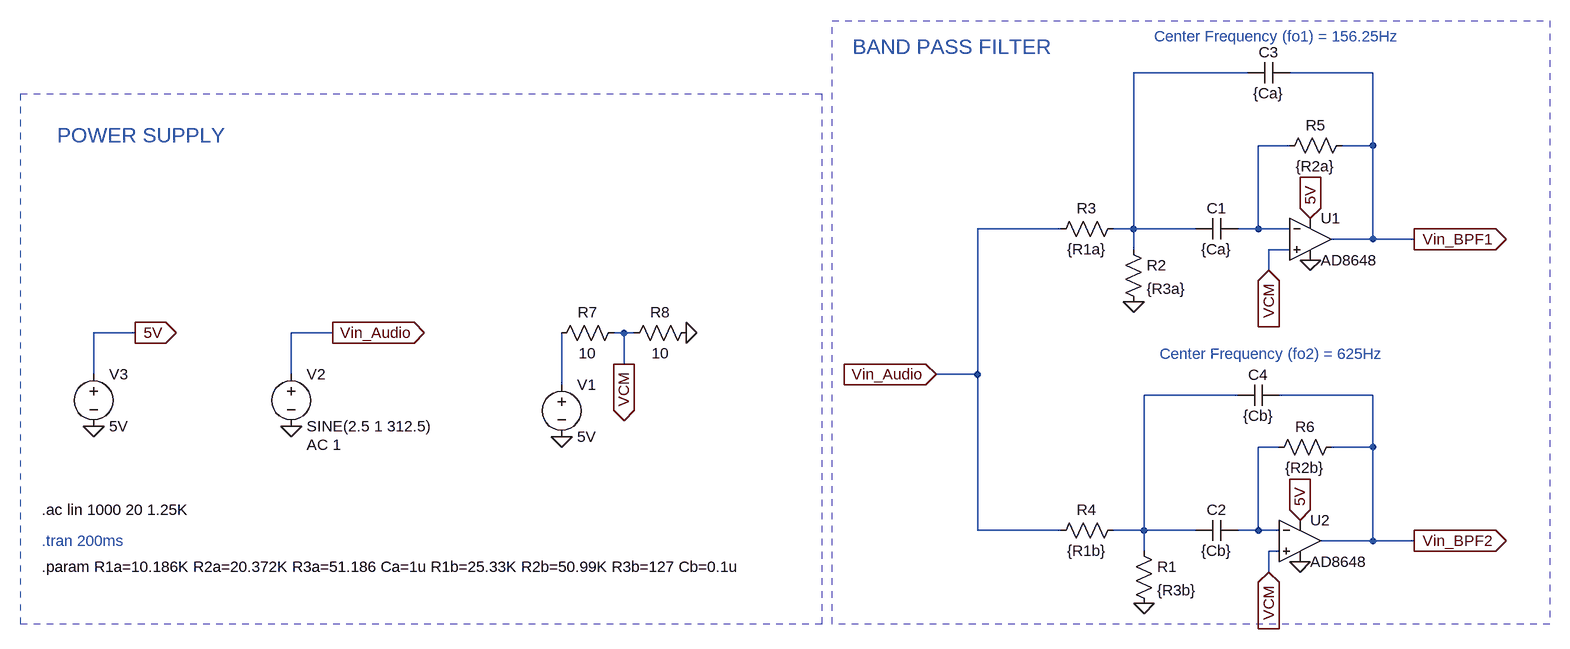
[diagram p0: schematic Analog4,5.asc]
Analog4,5.asc, the LTspice schematic file:
Version 4
SHEET 1 1492 1056
WIRE 256 -208 80 -208
WIRE 448 -208 320 -208
WIRE 320 -96 272 -96
WIRE 448 -96 448 -208
WIRE 448 -96 400 -96
WIRE -32 32 -160 32
WIRE 80 32 80 -208
WIRE 80 32 48 32
WIRE 176 32 80 32
WIRE 272 32 272 -96
WIRE 272 32 240 32
WIRE 320 32 272 32
WIRE 448 48 448 -96
WIRE 448 48 384 48
WIRE 512 48 448 48
WIRE 80 64 80 32
WIRE 320 64 288 64
WIRE 288 96 288 64
WIRE -1456 192 -1520 192
WIRE -1152 192 -1216 192
WIRE -704 192 -720 192
WIRE -688 192 -704 192
WIRE -704 240 -704 192
WIRE -1520 256 -1520 192
WIRE -1216 256 -1216 192
WIRE -160 256 -160 32
WIRE -160 256 -224 256
WIRE -800 272 -800 192
WIRE 240 288 96 288
WIRE 448 288 304 288
WIRE 304 368 272 368
WIRE 448 368 448 288
WIRE 448 368 384 368
WIRE -160 496 -160 256
WIRE -32 496 -160 496
WIRE 96 496 96 288
WIRE 96 496 48 496
WIRE 176 496 96 496
WIRE 272 496 272 368
WIRE 272 496 240 496
WIRE 304 496 272 496
WIRE 448 512 448 368
WIRE 448 512 368 512
WIRE 512 512 448 512
WIRE 96 528 96 496
WIRE 304 528 288 528
WIRE 288 560 288 528
FLAG 352 80 0
FLAG 80 144 0
FLAG 96 608 0
FLAG 336 544 0
FLAG -800 352 0
FLAG -1216 336 0
FLAG -1520 336 0
FLAG -608 192 0
FLAG -224 256 Vin_Audio
IOPIN -224 256 In
FLAG -1152 192 Vin_Audio
IOPIN -1152 192 Out
FLAG 512 48 Vin_BPF1
IOPIN 512 48 Out
FLAG 512 512 Vin_BPF2
IOPIN 512 512 Out
FLAG -1456 192 5V
IOPIN -1456 192 Out
FLAG 352 16 5V
IOPIN 352 16 In
FLAG 336 480 5V
IOPIN 336 480 In
FLAG -704 240 VCM
IOPIN -704 240 Out
FLAG 288 560 VCM
IOPIN 288 560 In
FLAG 288 96 VCM
IOPIN 288 96 In
SYMBOL OpAmps\\AD8648 352 -16 R0
SYMATTR InstName U1
SYMBOL OpAmps\\AD8648 336 448 R0
SYMATTR InstName U2
SYMBOL cap 240 16 R90
WINDOW 0 0 32 VBottom 2
WINDOW 3 32 32 VTop 2
SYMATTR InstName C1
SYMATTR Value {Ca}
SYMBOL cap 240 480 R90
WINDOW 0 0 32 VBottom 2
WINDOW 3 32 32 VTop 2
SYMATTR InstName C2
SYMATTR Value {Cb}
SYMBOL cap 320 -224 R90
WINDOW 0 0 32 VBottom 2
WINDOW 3 32 32 VTop 2
SYMATTR InstName C3
SYMATTR Value {Ca}
SYMBOL cap 304 272 R90
WINDOW 0 0 32 VBottom 2
WINDOW 3 32 32 VTop 2
SYMATTR InstName C4
SYMATTR Value {Cb}
SYMBOL res 80 512 R0
SYMATTR InstName R1
SYMATTR Value {R3b}
SYMBOL res 64 48 R0
SYMATTR InstName R2
SYMATTR Value {R3a}
SYMBOL res 64 16 R90
WINDOW 0 0 56 VBottom 2
WINDOW 3 32 56 VTop 2
SYMATTR InstName R3
SYMATTR Value {R1a}
SYMBOL res 64 480 R90
WINDOW 0 0 56 VBottom 2
WINDOW 3 32 56 VTop 2
SYMATTR InstName R4
SYMATTR Value {R1b}
SYMBOL res 416 -112 R90
WINDOW 0 0 56 VBottom 2
WINDOW 3 32 56 VTop 2
SYMATTR InstName R5
SYMATTR Value {R2a}
SYMBOL res 400 352 R90
WINDOW 0 0 56 VBottom 2
WINDOW 3 32 56 VTop 2
SYMATTR InstName R6
SYMATTR Value {R2b}
SYMBOL voltage -800 256 R0
WINDOW 123 0 0 Left 0
WINDOW 39 0 0 Left 0
SYMATTR InstName V1
SYMATTR Value 5V
SYMBOL voltage -1216 240 R0
WINDOW 123 24 124 Left 2
WINDOW 39 0 0 Left 0
SYMATTR Value2 AC 1
SYMATTR InstName V2
SYMATTR Value SINE(2.5 1 312.5)
SYMBOL voltage -1520 240 R0
WINDOW 123 0 0 Left 0
WINDOW 39 0 0 Left 0
SYMATTR InstName V3
SYMATTR Value 5V
SYMBOL res -704 176 R90
WINDOW 0 0 56 VBottom 2
WINDOW 3 32 56 VTop 2
SYMATTR InstName R7
SYMATTR Value 10
SYMBOL res -592 176 R90
WINDOW 0 0 56 VBottom 2
WINDOW 3 32 56 VTop 2
SYMATTR InstName R8
SYMATTR Value 10
TEXT -1600 512 Left 2 ;.tran 200ms
TEXT -1600 464 Left 2 !.ac lin 1000 20 1.25K
TEXT -1600 552 Left 2 !.param R1a=10.186K R2a=20.372K R3a=51.186 Ca=1u R1b=25.33K R2b=50.99K R3b=127 Cb=0.1u
TEXT -1576 -112 Left 3 ;POWER SUPPLY
TEXT -352 -248 Left 3 ;BAND PASS FILTER
TEXT 112 -264 Left 2 ;Center Frequency (fo1) = 156.25Hz
TEXT 120 224 Left 2 ;Center Frequency (fo2) = 625Hz
RECTANGLE Normal 720 640 -384 -288 2
RECTANGLE Normal -400 640 -1632 -176 2

The netlist it stands for:
* Analog4,5.asc
XU1 VCM N002 5V 0 Vin_BPF1 AD8648  ; pins In+ In- V+ V- OUT
XU2 VCM N005 5V 0 Vin_BPF2 AD8648  ; pins In+ In- V+ V- OUT
C1 N002 N001 {Ca}
C2 N005 N004 {Cb}
C3 Vin_BPF1 N001 {Ca}
C4 Vin_BPF2 N004 {Cb}
R1 N004 0 {R3b}
R2 N001 0 {R3a}
R3 N001 Vin_Audio {R1a}
R4 N004 Vin_Audio {R1b}
R5 Vin_BPF1 N002 {R2a}
R6 Vin_BPF2 N005 {R2b}
V1 N003 0 5V
V2 Vin_Audio 0 SINE(2.5 1 312.5) AC 1
V3 5V 0 5V
R7 VCM N003 10
R8 0 VCM 10
* .tran 200ms
.ac lin 1000 20 1.25K
.param R1a=10.186K R2a=20.372K R3a=51.186 Ca=1u R1b=25.33K R2b=50.99K R3b=127 Cb=0.1u
* POWER SUPPLY
* BAND PASS FILTER
* Center Frequency (fo1) = 156.25Hz
* Center Frequency (fo2) = 625Hz
.lib ADI.lib
.backanno
.end